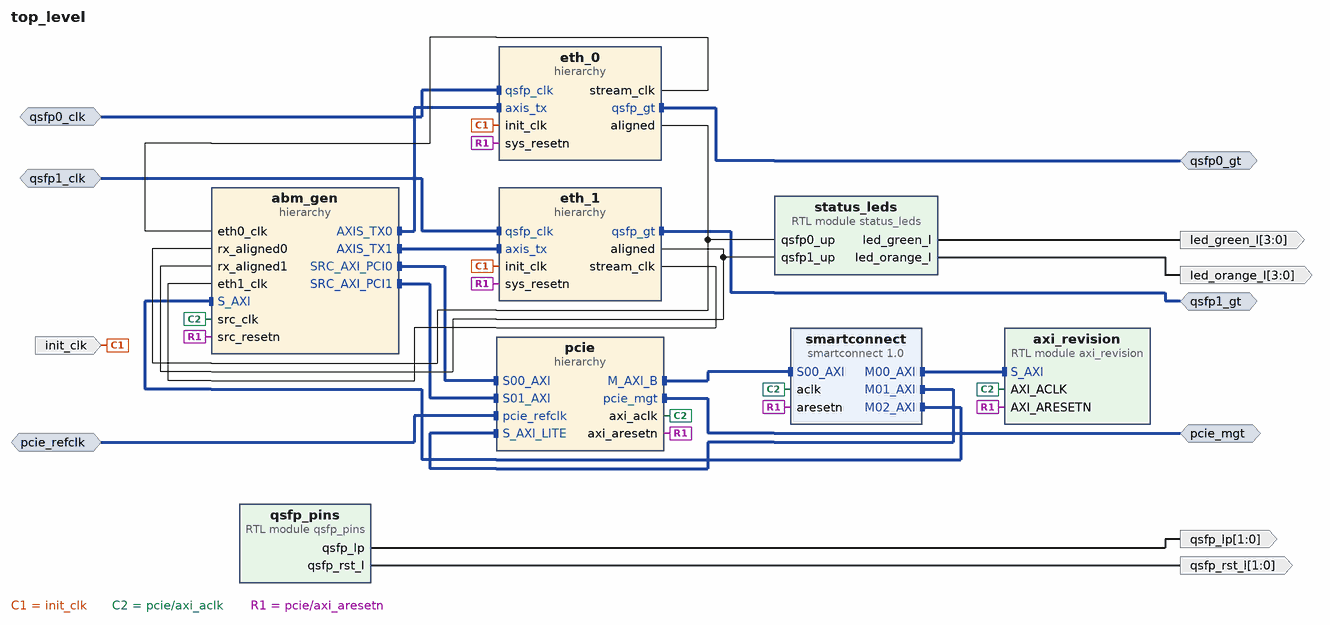
[diagram p0: block diagram of the top level]
# Vivado block design top_level, xcvu3p-ffvc1517-2-e, Vivado 2021.1
create_bd_design top_level

create_bd_intf_port -mode Slave -vlnv xilinx.com:interface:diff_clock_rtl:1.0 pcie_refclk
create_bd_intf_port -mode Master -vlnv xilinx.com:interface:pcie_7x_mgt_rtl:1.0 pcie_mgt
create_bd_intf_port -mode Slave -vlnv xilinx.com:interface:diff_clock_rtl:1.0 qsfp0_clk
set_property -dict {CONFIG.FREQ_HZ 322265625} [get_bd_intf_ports qsfp0_clk]
create_bd_intf_port -mode Master -vlnv xilinx.com:interface:gt_rtl:1.0 qsfp0_gt
create_bd_intf_port -mode Master -vlnv xilinx.com:interface:gt_rtl:1.0 qsfp1_gt
create_bd_intf_port -mode Slave -vlnv xilinx.com:interface:diff_clock_rtl:1.0 qsfp1_clk
set_property -dict {CONFIG.FREQ_HZ 322265625} [get_bd_intf_ports qsfp1_clk]
create_bd_port -dir O -from 3 -to 0 led_green_l
create_bd_port -dir O -from 3 -to 0 led_orange_l
create_bd_port -dir O -from 1 -to 0 qsfp_rst_l
create_bd_port -dir O -from 1 -to 0 qsfp_lp
create_bd_port -dir I init_clk

create_bd_cell -type hier pcie
create_bd_cell -type hier eth_0
create_bd_cell -type hier eth_1
create_bd_cell -type ip -vlnv xilinx.com:ip:smartconnect:1.0 smartconnect
set_property -dict {CONFIG.NUM_CLKS 1 CONFIG.NUM_MI 3 CONFIG.NUM_SI 1} [get_bd_cells smartconnect]
create_bd_cell -type module -reference status_leds status_leds
create_bd_cell -type module -reference qsfp_pins qsfp_pins
create_bd_cell -type hier abm_gen
create_bd_cell -type module -reference axi_revision axi_revision

# ---- hierarchy /pcie ----
current_bd_instance /pcie
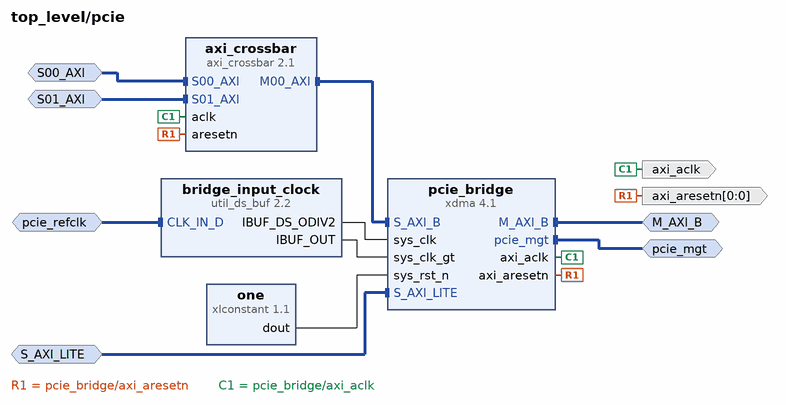
[diagram p1: block diagram inside /pcie]
create_bd_intf_pin -mode Master -vlnv xilinx.com:interface:aximm_rtl:1.0 M_AXI_B
create_bd_intf_pin -mode Slave -vlnv xilinx.com:interface:aximm_rtl:1.0 S_AXI_LITE
create_bd_intf_pin -mode Master -vlnv xilinx.com:interface:pcie_7x_mgt_rtl:1.0 pcie_mgt
create_bd_intf_pin -mode Slave -vlnv xilinx.com:interface:diff_clock_rtl:1.0 pcie_refclk
create_bd_intf_pin -mode Slave -vlnv xilinx.com:interface:aximm_rtl:1.0 S00_AXI
create_bd_intf_pin -mode Slave -vlnv xilinx.com:interface:aximm_rtl:1.0 S01_AXI
create_bd_pin -dir O -type clk axi_aclk
create_bd_pin -dir O -from 0 -to 0 -type rst axi_aresetn

create_bd_cell -type ip -vlnv xilinx.com:ip:util_ds_buf:2.2 bridge_input_clock
set_property -dict {CONFIG.C_BUF_TYPE IBUFDSGTE} [get_bd_cells bridge_input_clock]
create_bd_cell -type ip -vlnv xilinx.com:ip:xdma:4.1 pcie_bridge
set_property -dict [list \
  CONFIG.PF0_DEVICE_ID_mqdma 903F \
  CONFIG.PF0_SRIOV_VF_DEVICE_ID A03F \
  CONFIG.PF2_DEVICE_ID_mqdma 923F \
  CONFIG.PF3_DEVICE_ID_mqdma 933F \
  CONFIG.axi_addr_width 64 \
  CONFIG.axi_data_width 512_bit \
  CONFIG.axisten_freq 250 \
  CONFIG.bridge_burst true \
  CONFIG.dma_reset_source_sel User_Reset \
  CONFIG.en_axi_slave_if true \
  CONFIG.enable_jtag_dbg false \
  CONFIG.functional_mode AXI_Bridge \
  CONFIG.mode_selection Advanced \
  CONFIG.pcie_blk_locn X1Y0 \
  CONFIG.pf0_bar0_scale Megabytes \
  CONFIG.pf0_bar0_size 1 \
  CONFIG.pf0_bar1_enabled true \
  CONFIG.pf0_bar1_scale Megabytes \
  CONFIG.pf0_bar1_size 1 \
  CONFIG.pf0_device_id 903F \
  CONFIG.pl_link_cap_max_link_speed 8.0_GT/s \
  CONFIG.pl_link_cap_max_link_width X16 \
  CONFIG.plltype QPLL1 \
] [get_bd_cells pcie_bridge]
create_bd_cell -type ip -vlnv xilinx.com:ip:xlconstant:1.1 one
create_bd_cell -type ip -vlnv xilinx.com:ip:axi_crossbar:2.1 axi_crossbar
set_property -dict [list \
  CONFIG.M00_S00_WRITE_CONNECTIVITY 0 \
  CONFIG.M00_S01_WRITE_CONNECTIVITY 0 \
  CONFIG.NUM_MI 1 \
  CONFIG.NUM_SI 2 \
] [get_bd_cells axi_crossbar]

# ---- hierarchy /eth_0 ----
current_bd_instance /eth_0
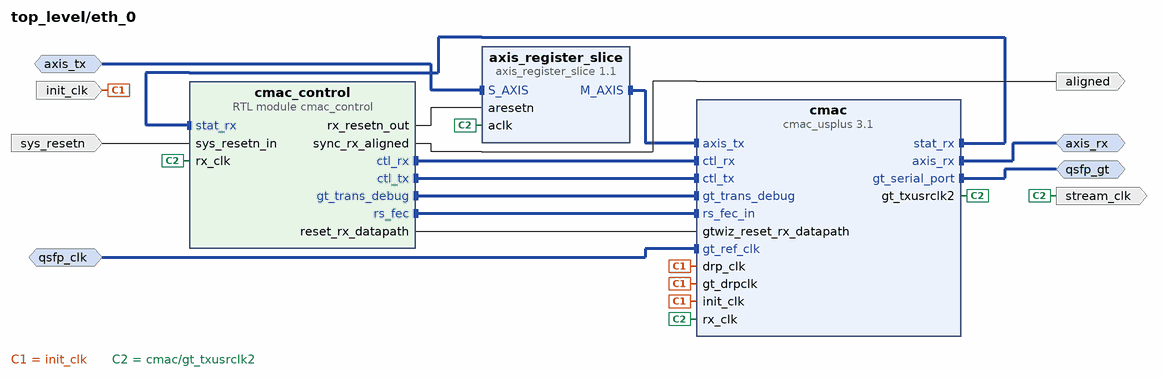
[diagram p2: block diagram inside /eth_0]
create_bd_intf_pin -mode Master -vlnv xilinx.com:interface:gt_rtl:1.0 qsfp_gt
create_bd_intf_pin -mode Slave -vlnv xilinx.com:interface:diff_clock_rtl:1.0 qsfp_clk
create_bd_intf_pin -mode Slave -vlnv xilinx.com:interface:axis_rtl:1.0 axis_tx
create_bd_intf_pin -mode Master -vlnv xilinx.com:interface:axis_rtl:1.0 axis_rx
create_bd_pin -dir I -type rst sys_resetn
create_bd_pin -dir O -type clk stream_clk
create_bd_pin -dir O aligned
create_bd_pin -dir I init_clk

create_bd_cell -type ip -vlnv xilinx.com:ip:cmac_usplus:3.1 cmac
set_property -dict [list \
  CONFIG.ADD_GT_CNRL_STS_PORTS 1 \
  CONFIG.CMAC_CAUI4_MODE 1 \
  CONFIG.CMAC_CORE_SELECT CMACE4_X0Y2 \
  CONFIG.GT_DRP_CLK 100 \
  CONFIG.GT_GROUP_SELECT {X0Y16~X0Y19} \
  CONFIG.GT_REF_CLK_FREQ 322.265625 \
  CONFIG.INCLUDE_RS_FEC 1 \
  CONFIG.NUM_LANES 4x25 \
  CONFIG.RX_FLOW_CONTROL 0 \
  CONFIG.TX_FLOW_CONTROL 0 \
  CONFIG.USER_INTERFACE AXIS \
] [get_bd_cells cmac]
create_bd_cell -type ip -vlnv xilinx.com:ip:axis_register_slice:1.1 axis_register_slice
create_bd_cell -type module -reference cmac_control cmac_control

# ---- hierarchy /eth_1 ----
current_bd_instance /eth_1
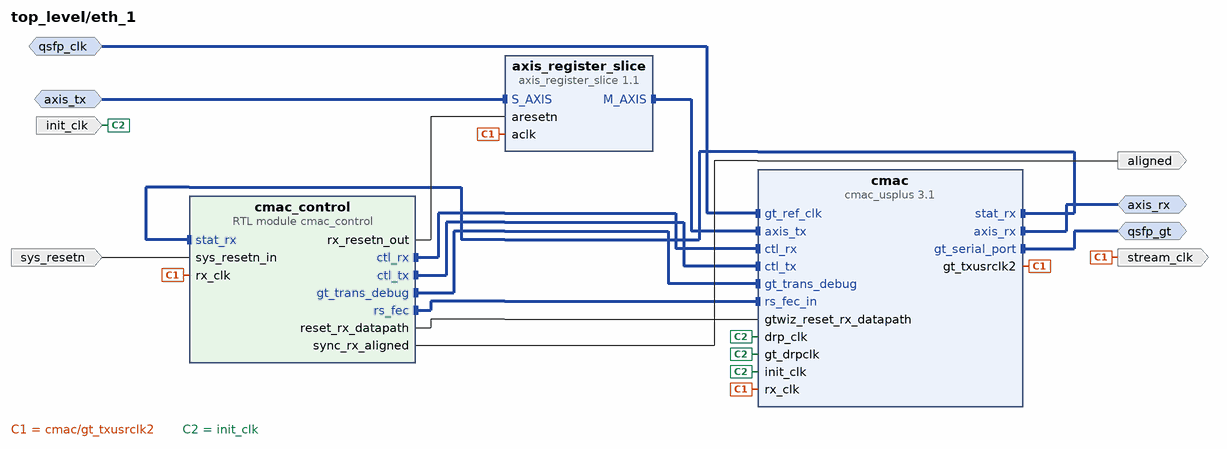
[diagram p3: block diagram inside /eth_1]
create_bd_intf_pin -mode Master -vlnv xilinx.com:interface:gt_rtl:1.0 qsfp_gt
create_bd_intf_pin -mode Slave -vlnv xilinx.com:interface:axis_rtl:1.0 axis_tx
create_bd_intf_pin -mode Master -vlnv xilinx.com:interface:axis_rtl:1.0 axis_rx
create_bd_intf_pin -mode Slave -vlnv xilinx.com:interface:diff_clock_rtl:1.0 qsfp_clk
create_bd_pin -dir I -type rst sys_resetn
create_bd_pin -dir O -type clk stream_clk
create_bd_pin -dir O aligned
create_bd_pin -dir I init_clk

create_bd_cell -type ip -vlnv xilinx.com:ip:cmac_usplus:3.1 cmac
set_property -dict [list \
  CONFIG.ADD_GT_CNRL_STS_PORTS 1 \
  CONFIG.CMAC_CAUI4_MODE 1 \
  CONFIG.CMAC_CORE_SELECT CMACE4_X0Y0 \
  CONFIG.GT_DRP_CLK 100 \
  CONFIG.GT_GROUP_SELECT {X0Y4~X0Y7} \
  CONFIG.GT_REF_CLK_FREQ 322.265625 \
  CONFIG.INCLUDE_RS_FEC 1 \
  CONFIG.NUM_LANES 4x25 \
  CONFIG.RX_FLOW_CONTROL 0 \
  CONFIG.TX_FLOW_CONTROL 0 \
  CONFIG.USER_INTERFACE AXIS \
] [get_bd_cells cmac]
create_bd_cell -type ip -vlnv xilinx.com:ip:axis_register_slice:1.1 axis_register_slice
create_bd_cell -type module -reference cmac_control cmac_control

# ---- hierarchy /abm_gen ----
current_bd_instance /abm_gen
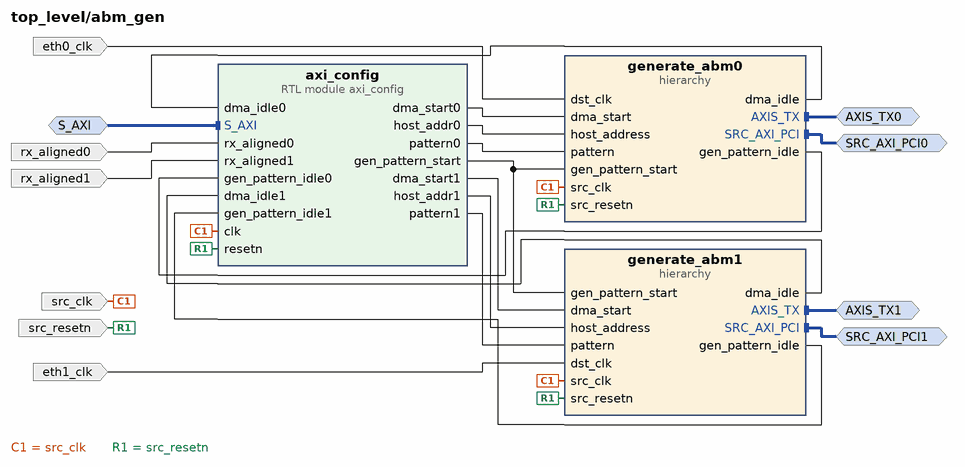
[diagram p4: block diagram inside /abm_gen]
create_bd_intf_pin -mode Slave -vlnv xilinx.com:interface:aximm_rtl:1.0 S_AXI
create_bd_intf_pin -mode Master -vlnv xilinx.com:interface:axis_rtl:1.0 AXIS_TX0
create_bd_intf_pin -mode Master -vlnv xilinx.com:interface:aximm_rtl:1.0 SRC_AXI_PCI0
create_bd_intf_pin -mode Master -vlnv xilinx.com:interface:axis_rtl:1.0 AXIS_TX1
create_bd_intf_pin -mode Master -vlnv xilinx.com:interface:aximm_rtl:1.0 SRC_AXI_PCI1
create_bd_pin -dir I -type clk src_clk
create_bd_pin -dir I -type rst src_resetn
create_bd_pin -dir I rx_aligned0
create_bd_pin -dir I rx_aligned1
create_bd_pin -dir I -type clk eth0_clk
create_bd_pin -dir I -type clk eth1_clk

create_bd_cell -type hier generate_abm0
create_bd_cell -type hier generate_abm1
create_bd_cell -type module -reference axi_config axi_config

# ---- hierarchy /abm_gen/generate_abm0 ----
current_bd_instance /abm_gen/generate_abm0
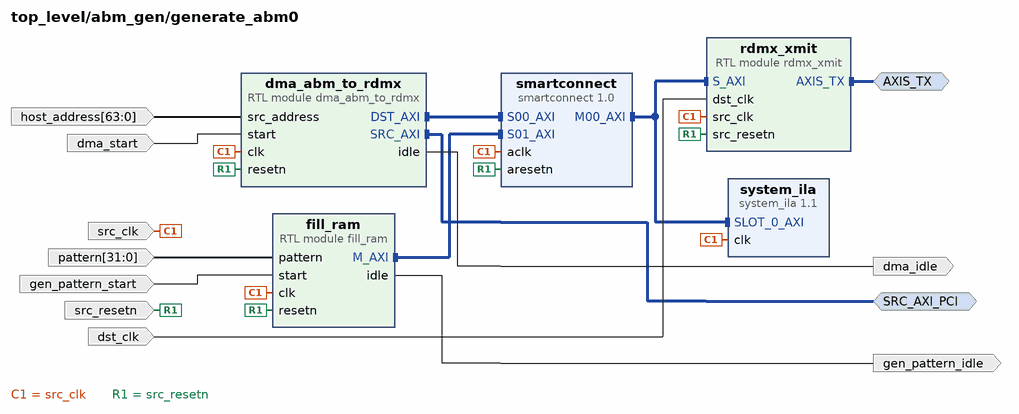
[diagram p5: block diagram inside /abm_gen/generate_abm0]
create_bd_intf_pin -mode Master -vlnv xilinx.com:interface:axis_rtl:1.0 AXIS_TX
create_bd_intf_pin -mode Master -vlnv xilinx.com:interface:aximm_rtl:1.0 SRC_AXI_PCI
create_bd_pin -dir I -type clk src_clk
create_bd_pin -dir I -type rst src_resetn
create_bd_pin -dir I -from 31 -to 0 pattern
create_bd_pin -dir I -type clk dst_clk
create_bd_pin -dir I gen_pattern_start
create_bd_pin -dir O gen_pattern_idle
create_bd_pin -dir I dma_start
create_bd_pin -dir I -from 63 -to 0 host_address
create_bd_pin -dir O dma_idle

create_bd_cell -type module -reference rdmx_xmit rdmx_xmit
create_bd_cell -type ip -vlnv xilinx.com:ip:system_ila:1.1 system_ila
set_property -dict {CONFIG.C_DATA_DEPTH 2048} [get_bd_cells system_ila]
create_bd_cell -type ip -vlnv xilinx.com:ip:smartconnect:1.0 smartconnect
create_bd_cell -type module -reference fill_ram fill_ram
create_bd_cell -type module -reference dma_abm_to_rdmx dma_abm_to_rdmx

# ---- hierarchy /abm_gen/generate_abm1 ----
current_bd_instance /abm_gen/generate_abm1
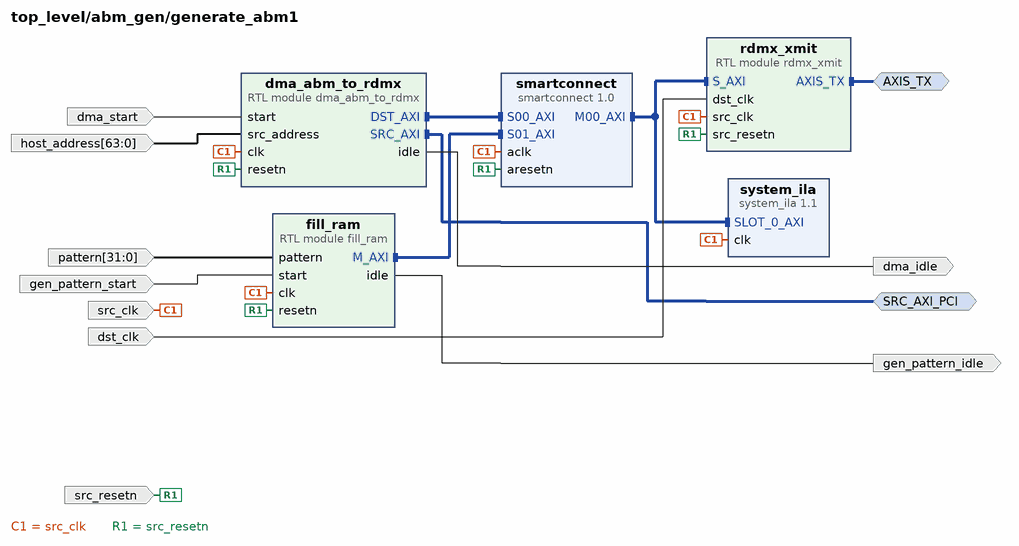
[diagram p6: block diagram inside /abm_gen/generate_abm1]
create_bd_intf_pin -mode Master -vlnv xilinx.com:interface:axis_rtl:1.0 AXIS_TX
create_bd_intf_pin -mode Master -vlnv xilinx.com:interface:aximm_rtl:1.0 SRC_AXI_PCI
create_bd_pin -dir I -type clk src_clk
create_bd_pin -dir I -type rst src_resetn
create_bd_pin -dir I -from 31 -to 0 pattern
create_bd_pin -dir I -type clk dst_clk
create_bd_pin -dir I gen_pattern_start
create_bd_pin -dir O gen_pattern_idle
create_bd_pin -dir I dma_start
create_bd_pin -dir O dma_idle
create_bd_pin -dir I -from 63 -to 0 host_address

create_bd_cell -type module -reference rdmx_xmit rdmx_xmit
create_bd_cell -type ip -vlnv xilinx.com:ip:system_ila:1.1 system_ila
set_property -dict {CONFIG.C_DATA_DEPTH 2048} [get_bd_cells system_ila]
create_bd_cell -type ip -vlnv xilinx.com:ip:smartconnect:1.0 smartconnect
create_bd_cell -type module -reference fill_ram fill_ram
create_bd_cell -type module -reference dma_abm_to_rdmx dma_abm_to_rdmx

# ---- connections ----

current_bd_instance /pcie
connect_bd_intf_net [get_bd_intf_pins pcie_refclk] [get_bd_intf_pins bridge_input_clock/CLK_IN_D]
connect_bd_intf_net [get_bd_intf_pins S00_AXI] [get_bd_intf_pins axi_crossbar/S00_AXI]
connect_bd_intf_net [get_bd_intf_pins S01_AXI] [get_bd_intf_pins axi_crossbar/S01_AXI]
connect_bd_intf_net [get_bd_intf_pins pcie_bridge/S_AXI_B] [get_bd_intf_pins axi_crossbar/M00_AXI]
connect_bd_intf_net [get_bd_intf_pins S_AXI_LITE] [get_bd_intf_pins pcie_bridge/S_AXI_LITE]
connect_bd_intf_net [get_bd_intf_pins M_AXI_B] [get_bd_intf_pins pcie_bridge/M_AXI_B]
connect_bd_intf_net [get_bd_intf_pins pcie_mgt] [get_bd_intf_pins pcie_bridge/pcie_mgt]
connect_bd_net [get_bd_pins bridge_input_clock/IBUF_DS_ODIV2] [get_bd_pins pcie_bridge/sys_clk]
connect_bd_net [get_bd_pins bridge_input_clock/IBUF_OUT] [get_bd_pins pcie_bridge/sys_clk_gt]
connect_bd_net [get_bd_pins one/dout] [get_bd_pins pcie_bridge/sys_rst_n]
connect_bd_net [get_bd_pins pcie_bridge/axi_aresetn] [get_bd_pins axi_aresetn] [get_bd_pins axi_crossbar/aresetn]
connect_bd_net -net xdma_0_axi_aclk [get_bd_pins pcie_bridge/axi_aclk] [get_bd_pins axi_aclk] [get_bd_pins axi_crossbar/aclk]

current_bd_instance /eth_0
connect_bd_intf_net [get_bd_intf_pins axis_register_slice/M_AXIS] [get_bd_intf_pins cmac/axis_tx]
connect_bd_intf_net [get_bd_intf_pins axis_tx] [get_bd_intf_pins axis_register_slice/S_AXIS]
connect_bd_intf_net [get_bd_intf_pins axis_rx] [get_bd_intf_pins cmac/axis_rx]
connect_bd_intf_net [get_bd_intf_pins cmac_control/ctl_rx] [get_bd_intf_pins cmac/ctl_rx]
connect_bd_intf_net [get_bd_intf_pins cmac_control/ctl_tx] [get_bd_intf_pins cmac/ctl_tx]
connect_bd_intf_net [get_bd_intf_pins cmac_control/gt_trans_debug] [get_bd_intf_pins cmac/gt_trans_debug]
connect_bd_intf_net [get_bd_intf_pins cmac_control/rs_fec] [get_bd_intf_pins cmac/rs_fec_in]
connect_bd_intf_net [get_bd_intf_pins cmac_control/stat_rx] [get_bd_intf_pins cmac/stat_rx]
connect_bd_intf_net [get_bd_intf_pins qsfp_gt] [get_bd_intf_pins cmac/gt_serial_port]
connect_bd_intf_net [get_bd_intf_pins qsfp_clk] [get_bd_intf_pins cmac/gt_ref_clk]
connect_bd_net -net clk_0_1 [get_bd_pins init_clk] [get_bd_pins cmac/init_clk] [get_bd_pins cmac/drp_clk] [get_bd_pins cmac/gt_drpclk]
connect_bd_net [get_bd_pins cmac_control/reset_rx_datapath] [get_bd_pins cmac/gtwiz_reset_rx_datapath]
connect_bd_net [get_bd_pins cmac_control/rx_resetn_out] [get_bd_pins axis_register_slice/aresetn]
connect_bd_net [get_bd_pins cmac_control/sync_rx_aligned] [get_bd_pins aligned]
connect_bd_net -net cmac_gt_rxusrclk2 [get_bd_pins cmac/gt_txusrclk2] \
  [get_bd_pins stream_clk] [get_bd_pins cmac/rx_clk] [get_bd_pins axis_register_slice/aclk] [get_bd_pins cmac_control/rx_clk]
connect_bd_net [get_bd_pins sys_resetn] [get_bd_pins cmac_control/sys_resetn_in]

current_bd_instance /eth_1
connect_bd_intf_net [get_bd_intf_pins qsfp_clk] [get_bd_intf_pins cmac/gt_ref_clk]
connect_bd_intf_net [get_bd_intf_pins axis_register_slice/M_AXIS] [get_bd_intf_pins cmac/axis_tx]
connect_bd_intf_net [get_bd_intf_pins axis_tx] [get_bd_intf_pins axis_register_slice/S_AXIS]
connect_bd_intf_net [get_bd_intf_pins axis_rx] [get_bd_intf_pins cmac/axis_rx]
connect_bd_intf_net [get_bd_intf_pins cmac_control/ctl_rx] [get_bd_intf_pins cmac/ctl_rx]
connect_bd_intf_net [get_bd_intf_pins cmac_control/ctl_tx] [get_bd_intf_pins cmac/ctl_tx]
connect_bd_intf_net [get_bd_intf_pins cmac_control/gt_trans_debug] [get_bd_intf_pins cmac/gt_trans_debug]
connect_bd_intf_net [get_bd_intf_pins cmac_control/rs_fec] [get_bd_intf_pins cmac/rs_fec_in]
connect_bd_intf_net [get_bd_intf_pins cmac_control/stat_rx] [get_bd_intf_pins cmac/stat_rx]
connect_bd_intf_net [get_bd_intf_pins qsfp_gt] [get_bd_intf_pins cmac/gt_serial_port]
connect_bd_net [get_bd_pins cmac_control/reset_rx_datapath] [get_bd_pins cmac/gtwiz_reset_rx_datapath]
connect_bd_net [get_bd_pins cmac_control/rx_resetn_out] [get_bd_pins axis_register_slice/aresetn]
connect_bd_net [get_bd_pins cmac_control/sync_rx_aligned] [get_bd_pins aligned]
connect_bd_net -net cmac_gt_rxusrclk2 [get_bd_pins cmac/gt_txusrclk2] \
  [get_bd_pins stream_clk] [get_bd_pins cmac/rx_clk] [get_bd_pins axis_register_slice/aclk] [get_bd_pins cmac_control/rx_clk]
connect_bd_net -net init_clk_divider_init_clk [get_bd_pins init_clk] \
  [get_bd_pins cmac/init_clk] [get_bd_pins cmac/drp_clk] [get_bd_pins cmac/gt_drpclk]
connect_bd_net [get_bd_pins sys_resetn] [get_bd_pins cmac_control/sys_resetn_in]

current_bd_instance /abm_gen
connect_bd_intf_net [get_bd_intf_pins SRC_AXI_PCI0] [get_bd_intf_pins generate_abm0/SRC_AXI_PCI]
connect_bd_intf_net [get_bd_intf_pins SRC_AXI_PCI1] [get_bd_intf_pins generate_abm1/SRC_AXI_PCI]
connect_bd_intf_net [get_bd_intf_pins AXIS_TX0] [get_bd_intf_pins generate_abm0/AXIS_TX]
connect_bd_intf_net [get_bd_intf_pins AXIS_TX1] [get_bd_intf_pins generate_abm1/AXIS_TX]
connect_bd_intf_net [get_bd_intf_pins S_AXI] [get_bd_intf_pins axi_config/S_AXI]
connect_bd_net [get_bd_pins axi_config/dma_start0] [get_bd_pins generate_abm0/dma_start]
connect_bd_net [get_bd_pins axi_config/dma_start1] [get_bd_pins generate_abm1/dma_start]
connect_bd_net [get_bd_pins axi_config/host_addr0] [get_bd_pins generate_abm0/host_address]
connect_bd_net [get_bd_pins axi_config/host_addr1] [get_bd_pins generate_abm1/host_address]
connect_bd_net [get_bd_pins axi_config/pattern0] [get_bd_pins generate_abm0/pattern]
connect_bd_net [get_bd_pins axi_config/pattern1] [get_bd_pins generate_abm1/pattern]
connect_bd_net -net axi_config_start [get_bd_pins axi_config/gen_pattern_start] \
  [get_bd_pins generate_abm0/gen_pattern_start] [get_bd_pins generate_abm1/gen_pattern_start]
connect_bd_net -net eth_0_stat_rx_aligned_0 [get_bd_pins rx_aligned0] [get_bd_pins axi_config/rx_aligned0]
connect_bd_net -net eth_0_stream_clk [get_bd_pins eth0_clk] [get_bd_pins generate_abm0/dst_clk]
connect_bd_net -net eth_1_stat_rx_aligned_0 [get_bd_pins rx_aligned1] [get_bd_pins axi_config/rx_aligned1]
connect_bd_net -net eth_1_stream_clk [get_bd_pins eth1_clk] [get_bd_pins generate_abm1/dst_clk]
connect_bd_net [get_bd_pins generate_abm0/dma_idle] [get_bd_pins axi_config/dma_idle0]
connect_bd_net -net generate_abm0_idle [get_bd_pins generate_abm0/gen_pattern_idle] [get_bd_pins axi_config/gen_pattern_idle0]
connect_bd_net [get_bd_pins generate_abm1/dma_idle] [get_bd_pins axi_config/dma_idle1]
connect_bd_net -net generate_abm1_idle [get_bd_pins generate_abm1/gen_pattern_idle] [get_bd_pins axi_config/gen_pattern_idle1]
connect_bd_net -net source_200Mhz_clk [get_bd_pins src_clk] \
  [get_bd_pins generate_abm0/src_clk] [get_bd_pins generate_abm1/src_clk] [get_bd_pins axi_config/clk]
connect_bd_net -net source_200Mhz_resetn [get_bd_pins src_resetn] \
  [get_bd_pins generate_abm0/src_resetn] [get_bd_pins generate_abm1/src_resetn] [get_bd_pins axi_config/resetn]

current_bd_instance /abm_gen/generate_abm0
connect_bd_intf_net [get_bd_intf_pins dma_abm_to_rdmx/DST_AXI] [get_bd_intf_pins smartconnect/S00_AXI]
connect_bd_intf_net [get_bd_intf_pins SRC_AXI_PCI] [get_bd_intf_pins dma_abm_to_rdmx/SRC_AXI]
connect_bd_intf_net [get_bd_intf_pins fill_ram/M_AXI] [get_bd_intf_pins smartconnect/S01_AXI]
connect_bd_intf_net [get_bd_intf_pins AXIS_TX] [get_bd_intf_pins rdmx_xmit/AXIS_TX]
connect_bd_intf_net [get_bd_intf_pins rdmx_xmit/S_AXI] [get_bd_intf_pins smartconnect/M00_AXI]
connect_bd_intf_net [get_bd_intf_pins rdmx_xmit/S_AXI] [get_bd_intf_pins system_ila/SLOT_0_AXI]
connect_bd_net -net axi_config_pattern0 [get_bd_pins pattern] [get_bd_pins fill_ram/pattern]
connect_bd_net [get_bd_pins dma_abm_to_rdmx/idle] [get_bd_pins dma_idle]
connect_bd_net -net eth_0_stream_clk [get_bd_pins dst_clk] [get_bd_pins rdmx_xmit/dst_clk]
connect_bd_net [get_bd_pins fill_ram/idle] [get_bd_pins gen_pattern_idle]
connect_bd_net -net source_200Mhz_clk [get_bd_pins src_clk] \
  [get_bd_pins rdmx_xmit/src_clk] [get_bd_pins system_ila/clk] [get_bd_pins smartconnect/aclk] [get_bd_pins fill_ram/clk] \
  [get_bd_pins dma_abm_to_rdmx/clk]
connect_bd_net -net source_200Mhz_resetn [get_bd_pins src_resetn] \
  [get_bd_pins rdmx_xmit/src_resetn] [get_bd_pins smartconnect/aresetn] [get_bd_pins fill_ram/resetn] \
  [get_bd_pins dma_abm_to_rdmx/resetn]
connect_bd_net -net src_address_1 [get_bd_pins host_address] [get_bd_pins dma_abm_to_rdmx/src_address]
connect_bd_net -net start_1 [get_bd_pins gen_pattern_start] [get_bd_pins fill_ram/start]
connect_bd_net -net start_2 [get_bd_pins dma_start] [get_bd_pins dma_abm_to_rdmx/start]

current_bd_instance /abm_gen/generate_abm1
connect_bd_intf_net [get_bd_intf_pins dma_abm_to_rdmx/DST_AXI] [get_bd_intf_pins smartconnect/S00_AXI]
connect_bd_intf_net [get_bd_intf_pins SRC_AXI_PCI] [get_bd_intf_pins dma_abm_to_rdmx/SRC_AXI]
connect_bd_intf_net [get_bd_intf_pins fill_ram/M_AXI] [get_bd_intf_pins smartconnect/S01_AXI]
connect_bd_intf_net [get_bd_intf_pins AXIS_TX] [get_bd_intf_pins rdmx_xmit/AXIS_TX]
connect_bd_intf_net [get_bd_intf_pins smartconnect/M00_AXI] [get_bd_intf_pins rdmx_xmit/S_AXI]
connect_bd_intf_net [get_bd_intf_pins smartconnect/M00_AXI] [get_bd_intf_pins system_ila/SLOT_0_AXI]
connect_bd_net -net axi_config_pattern1 [get_bd_pins pattern] [get_bd_pins fill_ram/pattern]
connect_bd_net [get_bd_pins dma_abm_to_rdmx/idle] [get_bd_pins dma_idle]
connect_bd_net [get_bd_pins dma_start] [get_bd_pins dma_abm_to_rdmx/start]
connect_bd_net -net eth_1_stream_clk [get_bd_pins dst_clk] [get_bd_pins rdmx_xmit/dst_clk]
connect_bd_net [get_bd_pins fill_ram/idle] [get_bd_pins gen_pattern_idle]
connect_bd_net [get_bd_pins host_address] [get_bd_pins dma_abm_to_rdmx/src_address]
connect_bd_net -net source_200Mhz_clk [get_bd_pins src_clk] \
  [get_bd_pins rdmx_xmit/src_clk] [get_bd_pins system_ila/clk] [get_bd_pins smartconnect/aclk] [get_bd_pins fill_ram/clk] \
  [get_bd_pins dma_abm_to_rdmx/clk]
connect_bd_net -net source_200Mhz_resetn [get_bd_pins src_resetn] \
  [get_bd_pins rdmx_xmit/src_resetn] [get_bd_pins smartconnect/aresetn] [get_bd_pins fill_ram/resetn] \
  [get_bd_pins dma_abm_to_rdmx/resetn]
connect_bd_net -net start_1 [get_bd_pins gen_pattern_start] [get_bd_pins fill_ram/start]

current_bd_instance /
connect_bd_intf_net [get_bd_intf_ports qsfp0_gt] [get_bd_intf_pins eth_0/qsfp_gt]
connect_bd_intf_net [get_bd_intf_ports qsfp1_gt] [get_bd_intf_pins eth_1/qsfp_gt]
connect_bd_intf_net [get_bd_intf_pins abm_gen/SRC_AXI_PCI0] [get_bd_intf_pins pcie/S00_AXI]
connect_bd_intf_net [get_bd_intf_pins abm_gen/SRC_AXI_PCI1] [get_bd_intf_pins pcie/S01_AXI]
connect_bd_intf_net [get_bd_intf_ports qsfp0_clk] [get_bd_intf_pins eth_0/qsfp_clk]
connect_bd_intf_net [get_bd_intf_ports qsfp1_clk] [get_bd_intf_pins eth_1/qsfp_clk]
connect_bd_intf_net [get_bd_intf_ports pcie_refclk] [get_bd_intf_pins pcie/pcie_refclk]
connect_bd_intf_net [get_bd_intf_pins abm_gen/AXIS_TX0] [get_bd_intf_pins eth_0/axis_tx]
connect_bd_intf_net [get_bd_intf_pins abm_gen/AXIS_TX1] [get_bd_intf_pins eth_1/axis_tx]
connect_bd_intf_net [get_bd_intf_pins pcie/S_AXI_LITE] [get_bd_intf_pins smartconnect/M01_AXI]
connect_bd_intf_net [get_bd_intf_pins axi_revision/S_AXI] [get_bd_intf_pins smartconnect/M00_AXI]
connect_bd_intf_net [get_bd_intf_pins abm_gen/S_AXI] [get_bd_intf_pins smartconnect/M02_AXI]
connect_bd_intf_net [get_bd_intf_pins pcie/M_AXI_B] [get_bd_intf_pins smartconnect/S00_AXI]
connect_bd_intf_net [get_bd_intf_ports pcie_mgt] [get_bd_intf_pins pcie/pcie_mgt]
connect_bd_net -net eth_0_stat_rx_aligned_0 [get_bd_pins eth_0/aligned] [get_bd_pins status_leds/qsfp0_up] [get_bd_pins abm_gen/rx_aligned0]
connect_bd_net [get_bd_pins eth_0/stream_clk] [get_bd_pins abm_gen/eth0_clk]
connect_bd_net -net eth_1_stat_rx_aligned_0 [get_bd_pins eth_1/aligned] [get_bd_pins status_leds/qsfp1_up] [get_bd_pins abm_gen/rx_aligned1]
connect_bd_net [get_bd_pins eth_1/stream_clk] [get_bd_pins abm_gen/eth1_clk]
connect_bd_net -net init_clk_0_1 [get_bd_ports init_clk] [get_bd_pins eth_1/init_clk] [get_bd_pins eth_0/init_clk]
connect_bd_net [get_bd_pins qsfp_pins/qsfp_lp] [get_bd_ports qsfp_lp]
connect_bd_net [get_bd_pins qsfp_pins/qsfp_rst_l] [get_bd_ports qsfp_rst_l]
connect_bd_net -net source_200Mhz_clk [get_bd_pins pcie/axi_aclk] \
  [get_bd_pins smartconnect/aclk] [get_bd_pins abm_gen/src_clk] [get_bd_pins axi_revision/AXI_ACLK]
connect_bd_net -net source_200Mhz_resetn [get_bd_pins pcie/axi_aresetn] \
  [get_bd_pins smartconnect/aresetn] [get_bd_pins eth_0/sys_resetn] [get_bd_pins eth_1/sys_resetn] \
  [get_bd_pins abm_gen/src_resetn] [get_bd_pins axi_revision/AXI_ARESETN]
connect_bd_net [get_bd_pins status_leds/led_green_l] [get_bd_ports led_green_l]
connect_bd_net [get_bd_pins status_leds/led_orange_l] [get_bd_ports led_orange_l]

# ---- address map ----
assign_bd_address -offset 0x0000000000000000 -range 4G -target_address_space [get_bd_addr_spaces abm_gen/generate_abm0/dma_abm_to_rdmx/DST_AXI] [get_bd_addr_segs abm_gen/generate_abm0/rdmx_xmit/S_AXI/reg0]
assign_bd_address -offset 0x0000000000000000 -range 16E -target_address_space [get_bd_addr_spaces abm_gen/generate_abm0/dma_abm_to_rdmx/SRC_AXI] [get_bd_addr_segs pcie/pcie_bridge/S_AXI_B/BAR0]
assign_bd_address -offset 0x00000000 -range 4G -target_address_space [get_bd_addr_spaces abm_gen/generate_abm0/fill_ram/M_AXI] [get_bd_addr_segs abm_gen/generate_abm0/rdmx_xmit/S_AXI/reg0]
assign_bd_address -offset 0x0000000000000000 -range 4G -target_address_space [get_bd_addr_spaces abm_gen/generate_abm1/dma_abm_to_rdmx/DST_AXI] [get_bd_addr_segs abm_gen/generate_abm1/rdmx_xmit/S_AXI/reg0]
assign_bd_address -offset 0x0000000000000000 -range 16E -target_address_space [get_bd_addr_spaces abm_gen/generate_abm1/dma_abm_to_rdmx/SRC_AXI] [get_bd_addr_segs pcie/pcie_bridge/S_AXI_B/BAR0]
assign_bd_address -offset 0x00000000 -range 4G -target_address_space [get_bd_addr_spaces abm_gen/generate_abm1/fill_ram/M_AXI] [get_bd_addr_segs abm_gen/generate_abm1/rdmx_xmit/S_AXI/reg0]
assign_bd_address -offset 0x0000000000000000 -range 128 -target_address_space [get_bd_addr_spaces pcie/pcie_bridge/M_AXI_B] [get_bd_addr_segs axi_revision/S_AXI/reg0]
assign_bd_address -offset 0x0000000000001000 -range 128 -target_address_space [get_bd_addr_spaces pcie/pcie_bridge/M_AXI_B] [get_bd_addr_segs abm_gen/axi_config/S_AXI/reg0]
assign_bd_address -offset 0x0000000000010000 -range 64K -target_address_space [get_bd_addr_spaces pcie/pcie_bridge/M_AXI_B] [get_bd_addr_segs pcie/pcie_bridge/S_AXI_LITE/CTL0]

validate_bd_design
save_bd_design
